# Altium schematic sheet Connectors.SchDoc
size A4; SheetNumber: 4; SheetTotal: 5
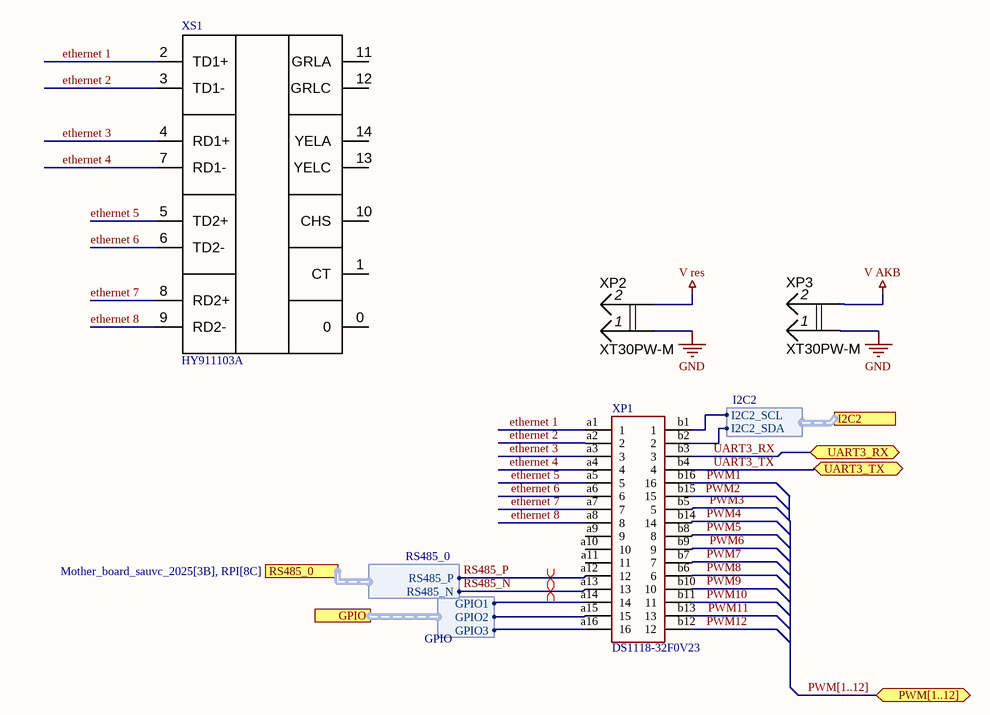
[diagram p0: Connectors.SchDoc]

## Parts
XP1  DS1118-32F0V23  [DS1118-32M0R23]
XP2  XT30PW-M  [XT30PW-M]
XP3  XT30PW-M  [XT30PW-M]
XS1  HY911103A  [HY911103A_HAN]

## Ports
GPIO (harness GPIO, see Mother_board_sauvc_2025[3B], RPI[4A]), I2C2 (harness I2C2, see Mother_board_sauvc_2025[3B], RPI[1B]), PWM[1..12] (bidir, see Mother_board_sauvc_2025[3B], RPI[7A]), RS485_0 (harness RS485_0, see Mother_board_sauvc_2025[3B], RPI[8C]), UART3_RX (bidir, see Mother_board_sauvc_2025[3B], RPI[2A]), UART3_TX (bidir, see Mother_board_sauvc_2025[3B], RPI[3A])

## Harnesses
GPIO: GPIO1, GPIO2, GPIO3
RS485_0: RS485_P, RS485_N
I2C2: I2C2_SCL, I2C2_SDA

## Nets
GND: XP2.1 XP3.1
V AKB: XP3.2
V res: XP2.2
ethernet 1: XP1.a1(1) XS1.2(TD1+)
ethernet 2: XP1.a2(2) XS1.3(TD1-)
ethernet 3: XP1.a3(3) XS1.4(RD1+)
ethernet 4: XP1.a4(4) XS1.7(RD1-)
ethernet 5: XP1.a5(5) XS1.5(TD2+)
ethernet 6: XP1.a6(6) XS1.6(TD2-)
ethernet 7: XP1.a7(7) XS1.8(RD2+)
ethernet 8: XP1.a8(8) XS1.9(RD2-)
PWM1: XP1.b16(16)
PWM2: XP1.b15(15)
PWM3: XP1.b5(5)
PWM4: XP1.b14(14)
PWM5: XP1.b8(8)
PWM6: XP1.b9(9)
PWM7: XP1.b7(7)
PWM8: XP1.b6(6)
PWM9: XP1.b10(10)
PWM10: XP1.b11(11)
PWM11: XP1.b13(13)
PWM12: XP1.b12(12)
RS485_N: XP1.a13(13) ; port RS485_0.RS485_N
RS485_P: XP1.a12(12) ; port RS485_0.RS485_P
UART3_RX: XP1.b3(3) ; port UART3_RX
UART3_TX: XP1.b4(4) ; port UART3_TX
NetXP1_a14: XP1.a14(14) ; port GPIO.GPIO1
NetXP1_a15: XP1.a15(15) ; port GPIO.GPIO2
NetXP1_a16: XP1.a16(16) ; port GPIO.GPIO3
NetXP1_b1: XP1.b1(1) ; port I2C2.I2C2_SCL
NetXP1_b2: XP1.b2(2) ; port I2C2.I2C2_SDA

Not connected (* = marked no-connect by the designer): XP1 a9(9) a10(10) a11(11); XS1 0 1(CT) 10(CHS) 11(GRLA) 12(GRLC) 13(YELC) 14(YELA)

## Buses and harness runs
bus PWM[1..12] = port PWM[1..12]

## Layout directives
differential pair: RS485_N, RS485_P

## Library data of the parts
XP2 XP3 = XT30PW-M: Manufacturer: AMASS; Type: XT; Part Number: XT30PW-M
XS1 = HY911103A: RG45; Manufacturer: HanRun; Part Number: HY911103A; Type: RG45